# EasyEDA schematic SCH_Carrier-Board_2026-08-28.json
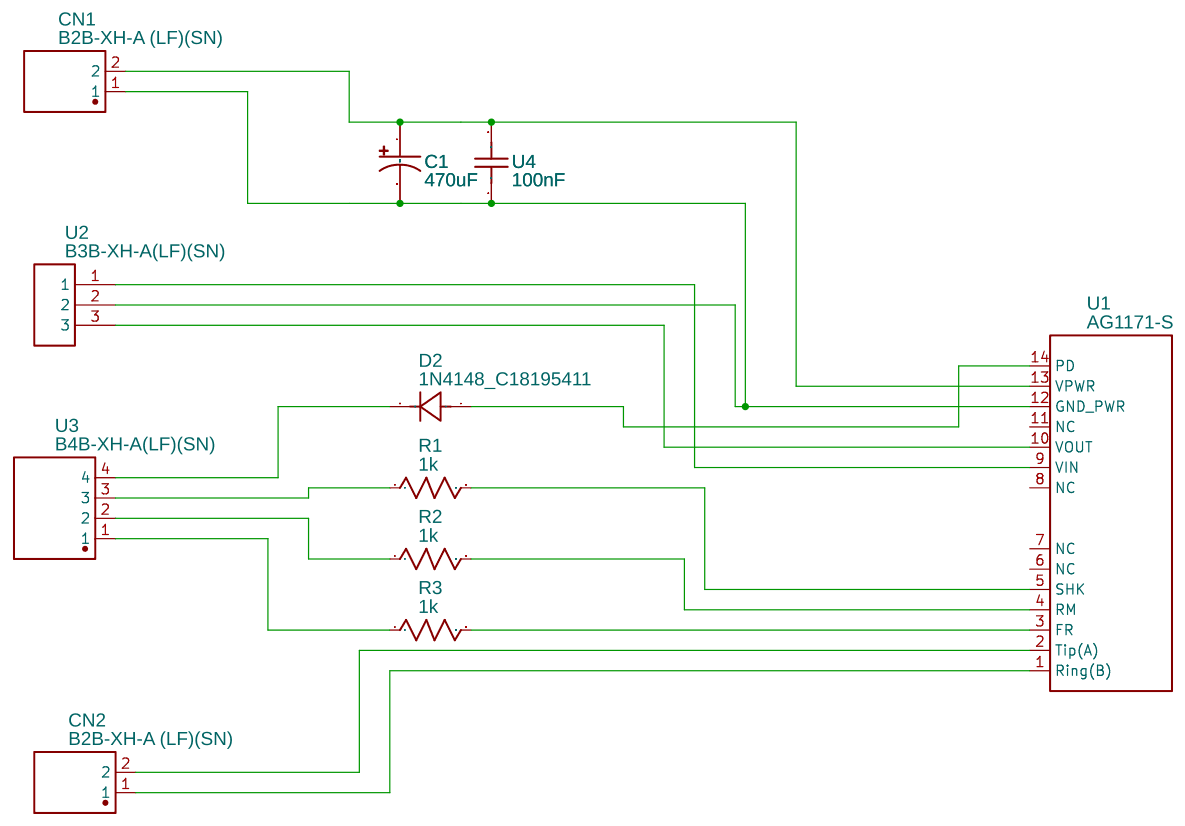
[diagram p0: schematic sheet]

## Parts
C1  470uF  [CAP-TH_BD10.0-P5.00-D1.0-FD]
CN1  B2B-XH-A (LF)(SN)  [CONN-TH_B2B-XH-A-LF-SN]
CN2  B2B-XH-A (LF)(SN)  [CONN-TH_B2B-XH-A-LF-SN]
D2  1N4148_C18195411  [DO-35_BD2.2-L4.0-D0.50_1N4148]
R1  1k  [R_AXIAL_DIN0207_L6.3MM_D2.5MM_P10.16MM_HORIZONTAL]
R2  1k  [R_AXIAL_DIN0207_L6.3MM_D2.5MM_P10.16MM_HORIZONTAL]
R3  1k  [R_AXIAL_DIN0207_L6.3MM_D2.5MM_P10.16MM_HORIZONTAL]
U1  AG1171-S  [PWRM-TH_L61.0-W12.0-P2.54]
U2  B3B-XH-A(LF)(SN)  [CONN-TH_3P-P2.50_A2501WV2-3P]
U3  B4B-XH-A(LF)(SN)  [CONN-TH_B4B-XH-A-LF-SN]
U4  100nF  [CAP-TH_L3.7-W2.1-P5.08-D0.5]

## Library data of the parts
C1 = UPW1C471MPD: Contributor: LCSC; Supplier: LCSC; Supplier Part: C125985; Manufacturer: Nichicon(尼吉康); JLCPCB Part Class: Extended Part
CN1 CN2 = B2B-XH-A (LF)(SN): Contributor: LCSC; Supplier: LCSC; Supplier Part: C158012; Manufacturer: JST; Manufacturer Part: B2B-XH-A(LF)(SN); JLCPCB Part Class: Extended Part
D2 = 1N4148_C18195411: Supplier: LCSC; Supplier Part: C18195411; Manufacturer: LJ(朗捷); Manufacturer Part: 1N4148; JLCPCB Part Class: Extended Part; Contributor: lcsc
R1-R3 = R_0603_US: Contributor: LCEDA_Lib
U1 = AG1171-S: Supplier: LCSC; Supplier Part: C20467695; Manufacturer: Silvertel; JLCPCB Part Class: Extended Part; Contributor: lcsc
U2 = B3B-XH-A(LF)(SN): Contributor: LCSC; Supplier: LCSC; Supplier Part: C144394; Manufacturer: JST; JLCPCB Part Class: Extended Part
U3 = B4B-XH-A(LF)(SN): Contributor: LCSC; Supplier: LCSC; Supplier Part: C144395; Manufacturer: JST; JLCPCB Part Class: Extended Part
U4 = K104K10X7RF5UH5: Contributor: lcsc; Supplier: LCSC; Supplier Part: C2979769; Manufacturer: VISHAY(威世); JLCPCB Part Class: Extended Part

## Nets
Net-(C1-1): C1.1 CN1.2 U1.13(VPWR) U4.2
Net-(C1-2): C1.2 CN1.1 U1.12(GND PWR) U2.2 U4.1
Net-(CN2-1): CN2.1 U1.1(Ring(B))
Net-(CN2-2): CN2.2 U1.2(Tip(A))
Net-(D2-1): D2.1(A) U1.14(PD)
Net-(D2-2): D2.2(C) U3.4
Net-(R1-1): R1.1 U3.3
Net-(R1-2): R1.2 U1.5(SHK)
Net-(R2-1): R2.1 U3.2
Net-(R2-2): R2.2 U1.4(RM)
Net-(R3-1): R3.1 U3.1
Net-(R3-2): R3.2 U1.3(FR)
Net-(U1-9): U1.9(VIN) U2.1
Net-(U1-10): U1.10(VOUT) U2.3

Not connected (* = marked no-connect by the designer): U1 6(NC) 7(NC) 8(NC) 11(NC)
